# EAGLE design Tiny_Sensor_Schematic (EAGLE 9.7.0)
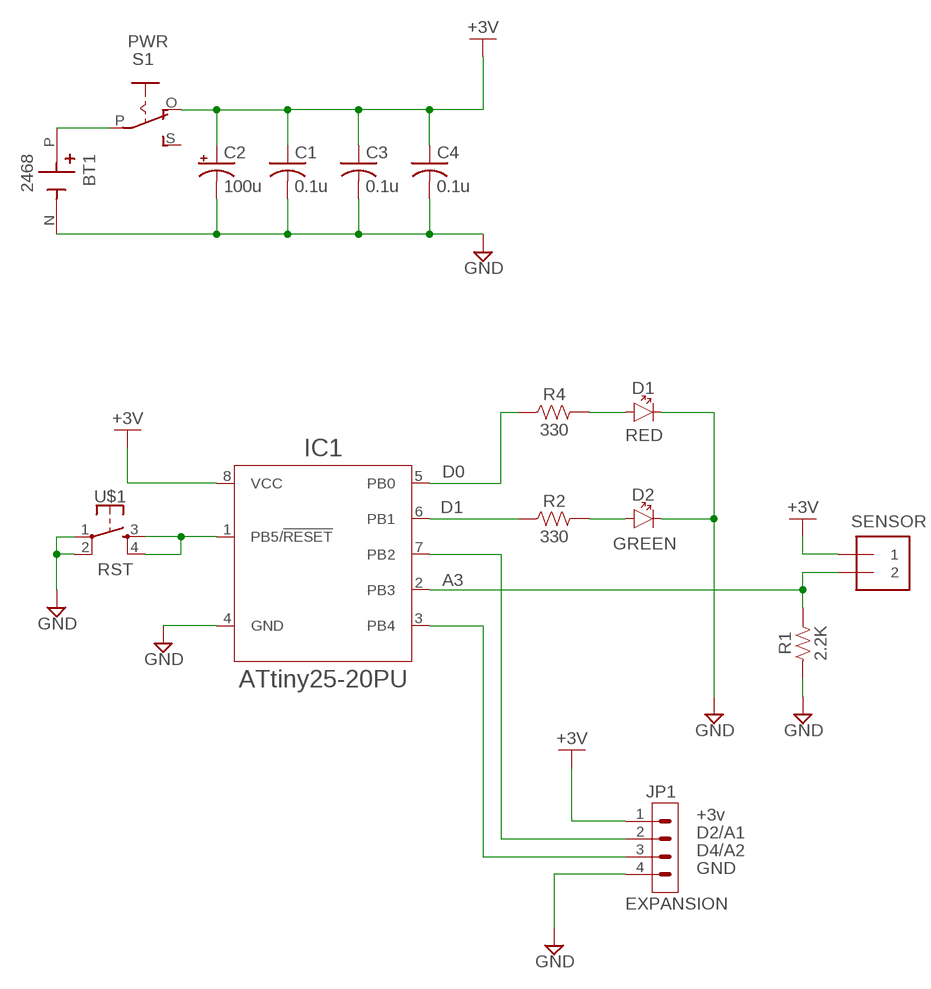
[diagram p0: schematic, sheet 1]

## Parts
BT1  2468  [BAT_2468]
C1  0.1u  C-US025-030X050  [C025-030X050]
C2  100u  CPOL-USE2-5  [E2-5]
C3  0.1u  C-US025-030X050  [C025-030X050]
C4  0.1u  C-US025-030X050  [C025-030X050]
D1  LED_RADIALRED  [LEDRD254W60D565H860B_R]
D2  LED_RADIALYELLOW  [LEDRD254W60D565H860B_Y]
IC1  ATtiny25-20PU  ATTINY25-20PU-8P_PDIP  [DIP787W55P254L958H533Q8B-8P3]
J1  1X2-3.5MM  [1X2-3.5MM]
JP1  PINHD-1X4  [1X04]
R1  2.2K  R-US_AXIAL-11.7MM-PITCH  [RESAD1176W63L850D250B]
R2  330  R-US_AXIAL-11.7MM-PITCH  [RESAD1176W63L850D250B]
R4  330  R-US_AXIAL-11.7MM-PITCH  [RESAD1176W63L850D250B]
S1  EG1218S  [EG1218]
U$1  SWITCH_MOMENTARY  [SWITCH-MOMENTARY-PTH-6.5MM]

## Nets
+3V: C1.1 C2.+ C3.1 C4.1 IC1.8(VCC) J1.1 JP1.1 S1.O
A3: IC1.2(PB3) J1.2 R1.2
D0: IC1.5(PB0) R4.1
D1: IC1.6(PB1) R2.1
GND: BT1.N(NEG) C1.2 C2.- C3.2 C4.2 D1.C D2.C IC1.4(GND) JP1.4 R1.1 U$1.1 U$1.2
N$1: BT1.P(POS) S1.P
N$2: IC1.1(PB5/!RESET!) U$1.3 U$1.4
N$3: D1.A R4.2
N$4: IC1.7(PB2) JP1.2
N$5: D2.A R2.2
N$6: IC1.3(PB4) JP1.3
Unconnected: S1.S

## Notes on the sheet
- PWR
- RED
- SENSOR
- GREEN
- RST
- +3v
- D2/A1
- D4/A2
- GND
- EXPANSION

## Library data of the parts
BT1 = AAA PCB Battery Holder:2468
C1 C3 C4 = adafruit:C-US: CAPACITOR, American symbol
C2 = adafruit:CPOL-US: POLARIZED CAPACITOR, American symbol
D1 D2 = Opto-Electronic:LED_RADIAL: LED - Generic
IC1 = Tinkercad:ATTINY*-8P: Atmel tiny25/45/85, 8-bit AVR Microcontroller with 2/4/8K Bytes In-System Programmable Flash Datasheet <https://ww1.microchip.com/downloads/en/DeviceDoc/Atmel-2586-AVR-8-bit-Microcontroller-ATtiny25-ATtiny45-ATtiny85_Datasheet.pdf>
J1 = adafruit:1X2: 3.5mm Terminal block http://www.ladyada.net/library/pcb/eaglelibrary.html
JP1 = Connector:PINHD-1X4: Pin Header
R1 R2 R4 = Resistor:R-US: Resistor Fixed - ANSI
S1 = adafruit:EG1218: SLIDING SWITCH 0.1" spacing through hole, vertical SPDT slide switch http://www.ladyada.net/library/pcb/eaglelibrary.html
U$1 = Tinkercad:SWITCH_MOMENTARY

## Board
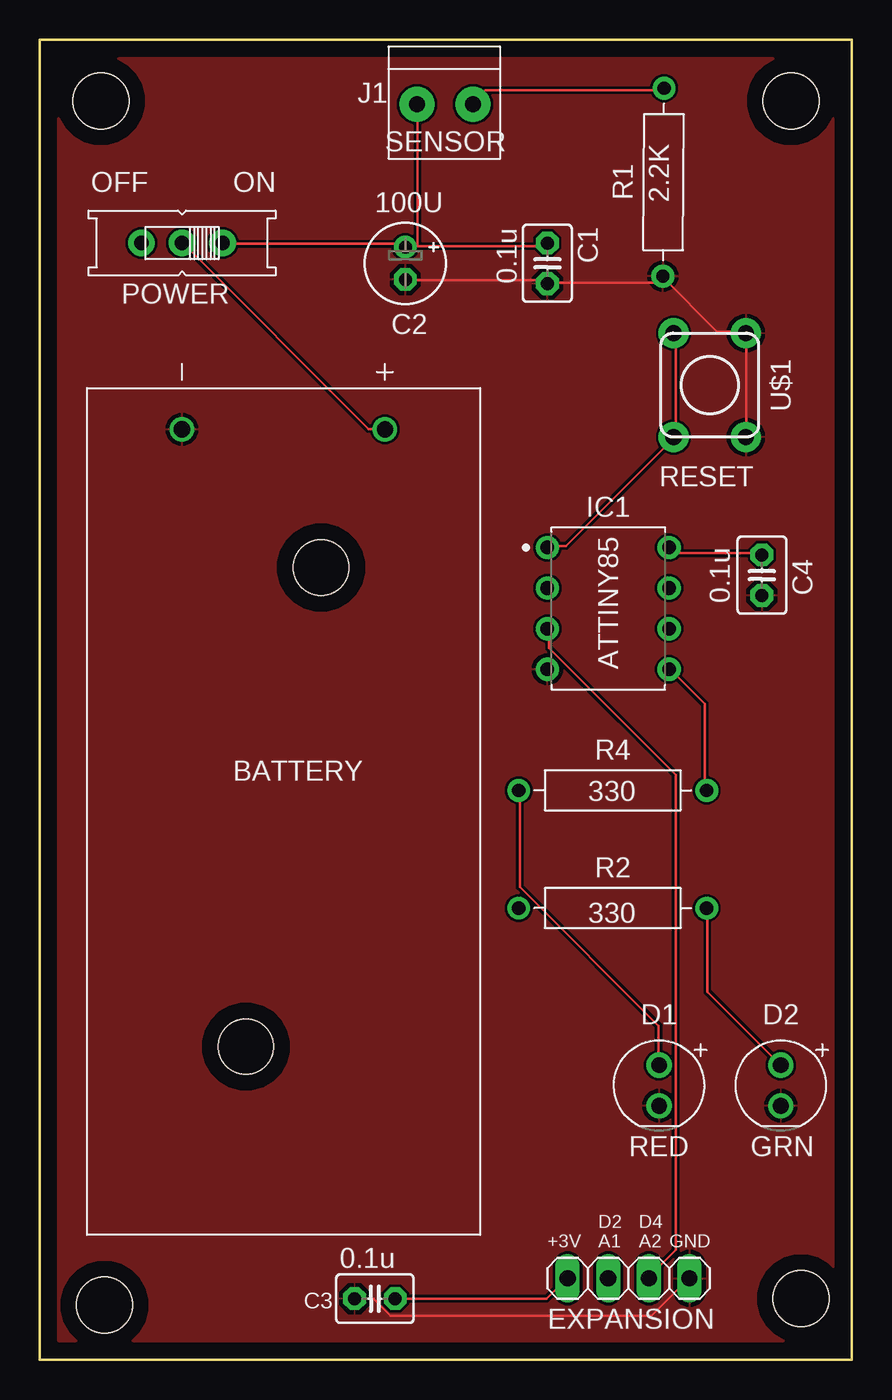
[diagram p1: board, top side]
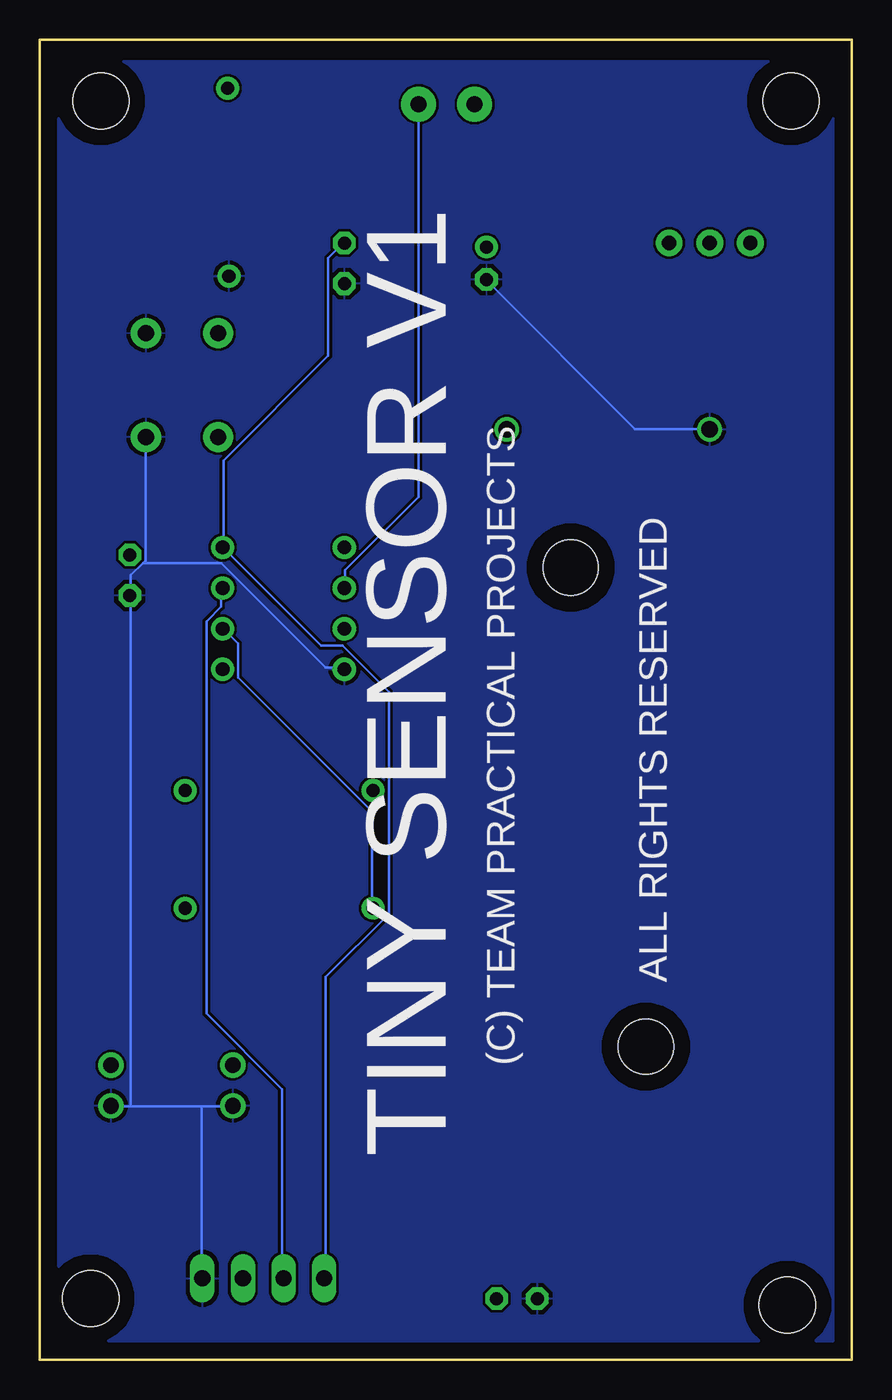
[diagram p2: board, bottom side, seen from below]

Size 50.8 x 82.55 mm. Coordinates in mm from the lower left corner, seen from the top.
Outline: 0,0 50.8,0 50.8,82.55 0,82.55 0,0
Copper layers (1*16): Top / Bottom
Stack-up Default Layer Stack: Top SilkScreen Epoxy Ink / Top SolderMask SR:Green 0.0254mm Dk 4.3 / Top Surface Finish Lead-Free 0.02mm / Top CuFoil:007 0.035mm / Dielectric-1 User Defined 1.5mm / Bottom CuFoil:007 0.035mm / Bottom Surface Finish Lead-Free 0.02mm / Bottom SolderMask SR:Green 0.0254mm Dk 4.3 / Bottom SilkScreen Epoxy Ink
Design rules: minimum copper width 6mil, minimum drill size 0.35mm, copper clearance wire_polygon to wire_polygon 6mil, copper clearance wire_polygon to pad_smd 6mil, copper clearance wire_polygon to via 6mil, copper clearance pad_smd to pad_smd 6mil, copper clearance pad_smd to via 6mil, copper clearance via to via 6mil, copper clearance smd to pad (same net) 6mil, copper clearance smd to via (same net) 6mil, copper clearance smd to smd (same net) 6mil, dimension clearance 40mil, restrict clearance 0mil, via restrict clearance 0mil, drill distance 6mil, keepout clearance 0mil
Holes 3.5 mm at 3.81,78.74 46.99,78.74 47.62,3.81 4.04,3.4

### Footprints (pad centres in the part's own frame; a part is rotated, then mirrored left to right if it is on the bottom)
BAT_2468 = drill 1.02: N 23.9,6.35; P 23.9,-6.35 | hole 3.45: -14.71,2.35; 15.26,-2.35
C025-030X050 = drill 0.813 pad 1.422 octagon: 1 -1.27,0; 2 1.27,0
E2-5 = drill 0.813 pad 1.422: + -1.016,0 | drill 0.813 pad 1.422 octagon: - 1.016,0
LEDRD254W60D565H860B_R = drill 0.981 pad 1.581: A -1.27,0; C 1.27,0
LEDRD254W60D565H860B_Y = drill 0.981 pad 1.581: A -1.27,0; C 1.27,0
DIP787W55P254L958H533Q8B-8P3 = drill 0.852 pad 1.452: 1 -3.81,3.81; 2 -3.81,1.27; 3 -3.81,-1.27; 4 -3.81,-3.81; 5 3.81,-3.81; 6 3.81,-1.27; 7 3.81,1.27; 8 3.81,3.81
1X2-3.5MM = drill 1 pad 2.184: 1 1.8,0; 2 -1.7,0
1X04 = drill 1.016 long: 1 -3.81,0; 2 -1.27,0; 3 1.27,0; 4 3.81,0
RESAD1176W63L850D250B = drill 0.83 pad 1.43: 1 -5.88,0; 2 5.88,0
EG1218 = drill 0.9 pad 1.676: O -2.54,0; P 0,0; S 2.54,0
SWITCH-MOMENTARY-PTH-6.5MM = drill 1.016 pad 1.88: 1 -3.251,2.261; 2 3.251,2.261; 3 -3.251,-2.261; 4 3.251,-2.261

### Placement (x,y rotation side)
BT1  15.24,34.29 90 top
C1  31.75,68.58 270 top
C2  22.86,68.58 270 top
C3  20.95,3.81 180 top
C4  45.17,49.07 270 top
D1  38.73,17.14 270 top
D2  46.35,17.14 270 top
IC1  35.56,46.99 0 top
J1  25.4,78.53 180 top
JP1  36.83,5.08 0 top
R1  39.02,73.66 89.6 top
R2  35.84,28.24 0 top
R4  35.84,35.6 180 top
S1  8.89,69.85 180 top
U$1  41.91,60.96 270 top

### Tracks (layer width: path | path; a pad name or v marks a point on that pad's centre or on a via)
+3V
  Top 0.152: C3.1 22.25,3.81 31.7,3.81 32.92,5.03 JP1.1 | C4.1 45.11,50.44 39.78,50.44 39.47,50.75 IC1.8 | 23.62,69.65 31.55,69.65 31.7,69.8 C1.1 | 23.62,69.65 22.86,69.65 | 22.86,69.65 C2.+ 22.86,69.65 | 22.86,69.65 22.71,69.8 11.43,69.8 S1.O | 23.62,69.65 23.62,78.49 J1.1
  Bottom 0.152: C1.1 31.85,69.8 32.77,68.89 32.77,62.79 39.32,56.24 39.32,50.9 IC1.8 39.32,50.75 33.22,44.65 31.85,44.65 28.96,41.76 28.96,27.89 32.92,23.93 32.92,5.18 JP1.1
A3
  Top 0.152: R1.2 39.01,79.4 27.89,79.4 27.13,78.64 J1.2
  Bottom 0.152: IC1.2 31.7,48.31 31.7,49.38 27.13,53.95 27.13,78.49 J1.2
D0
  Top 0.152: R4.1 41.6,35.66 41.6,41 39.47,43.13 IC1.5
D1
  Bottom 0.152: R2.1 30.02,28.35 30.02,34.29 38.41,42.67 38.41,44.81 39.32,45.72 IC1.6
GND
  Top 0.152: C3.2 19.81,3.81 20.88,3.81 21.95,2.74 38.25,2.74 40.54,5.03 JP1.4 | U$1.2 44.2,57.76 44.2,64.16 U$1.1 44.04,64.31 42.37,64.31 39.01,67.67 R1.1 38.86,67.67 38.56,67.36 31.85,67.36 C1.2 31.7,67.36 31.55,67.51 22.86,67.51 C2.-
  Bottom 0.152: 45.11,15.85 46.33,15.85 D2.C | 45.11,15.85 40.69,15.85 | 40.69,15.85 38.86,15.85 D1.C | 40.69,15.85 40.69,5.18 JP1.4 | 44.35,49.84 44.2,49.99 44.2,57.61 U$1.2 | 44.35,49.84 45.11,49.07 45.11,47.85 C4.2 45.11,47.7 45.11,15.85 | 44.35,49.84 39.47,49.84 32.92,43.28 31.85,43.28 IC1.4 | BT1.N 8.99,58.22 13.56,58.22 22.86,67.51 C2.-
  pour Top: 0,83.82 0,0 50.8,0 50.8,83.82 50.8,81.28 50.8,83.82
  pour Bottom: 0,0 0,83.82 0,81.28 50.8,81.28 50.8,0
N$1
  Top 0.152: BT1.P 21.49,58.22 20.57,58.22 8.99,69.8 S1.P
N$2
  Top 0.152: IC1.1 31.85,50.9 32.92,50.9 39.62,57.61 U$1.4 39.78,57.76 39.78,64.16 U$1.3
N$3
  Top 0.152: R4.2 30.02,35.51 30.02,29.57 38.71,20.88 38.71,18.44 D1.A
N$4
  Bottom 0.152: IC1.7 39.47,48.16 39.47,47.09 40.39,46.18 40.39,21.64 35.66,16.92 35.66,5.18 JP1.2
N$5
  Top 0.152: R2.2 41.76,28.19 41.76,23.01 46.33,18.44 D2.A
N$6
  Top 0.152: IC1.3 31.85,45.72 31.85,44.5 39.78,36.58 39.78,6.86 38.1,5.18 JP1.3

### Text on the board
SilkscreenTop: SENSOR | OFF | ON | 100U | 2.2K | 0.1u | POWER | RESET | 0.1u | ATTINY85 | BATTERY | 330 | 330 | RED | GRN | 0.1u | +3V | D2 / A1 | D4 / A2 | GND | C3 | EXPANSION
SilkscreenBottom: (C) TEAM PRACTICAL PROJECTS | ALL RIGHTS RESERVED | TINY SENSOR V1